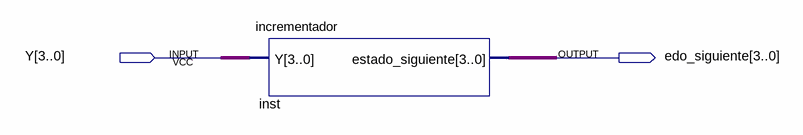
[diagram p0: schematic sheet]
// Quartus schematic increm.bdf as structural Verilog: 1 symbols, 2 pins
module increm (
  input  [3:0] Y,
  output [3:0] edo_siguiente
);

  incrementador inst (.Y(Y), .estado_siguiente(edo_siguiente));
endmodule
